# Altium schematic sheet 2代原理图.SchDoc
size A2; Organization: 电子产品世界
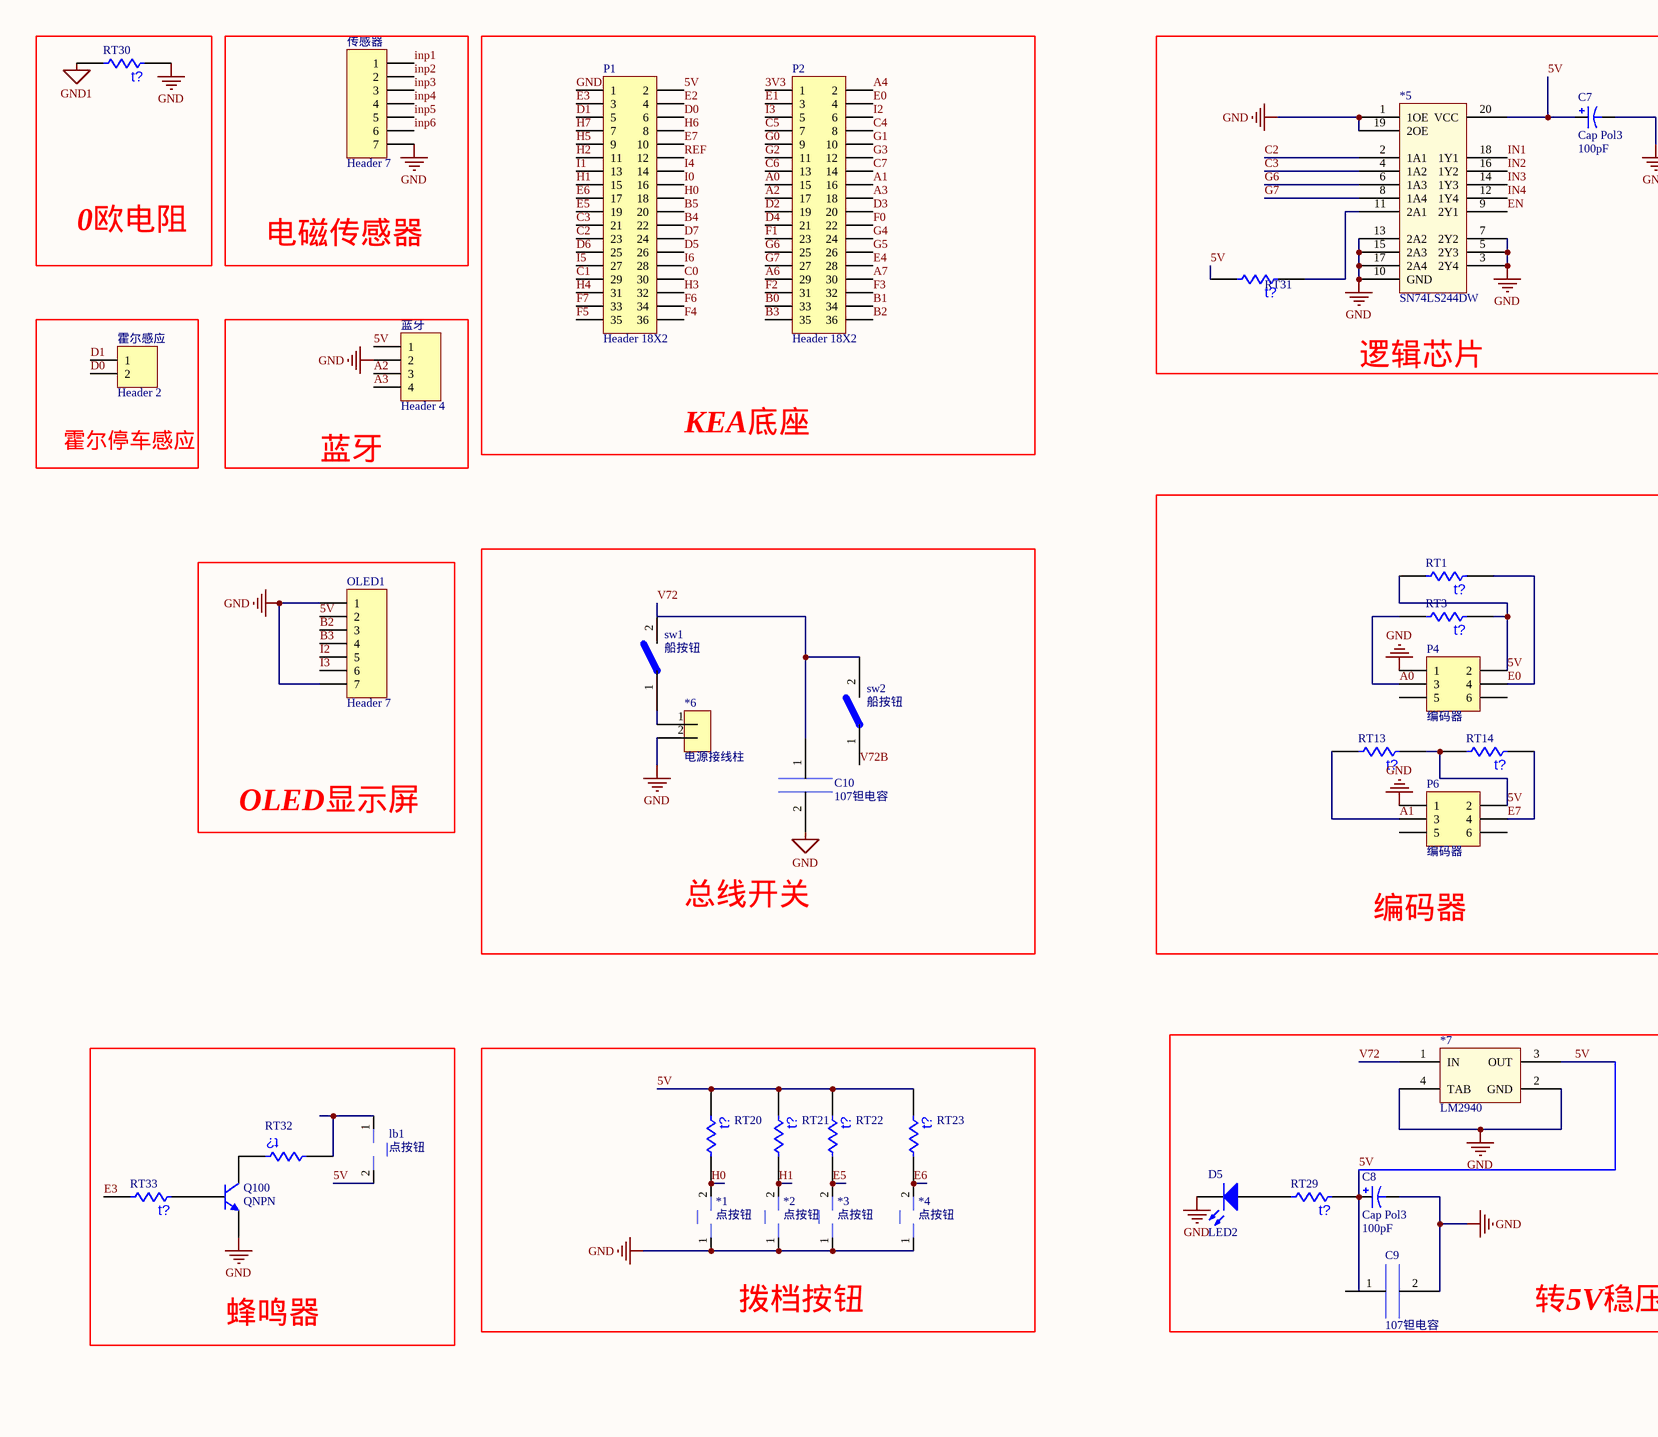
[diagram p0: 2代原理图.SchDoc, left]
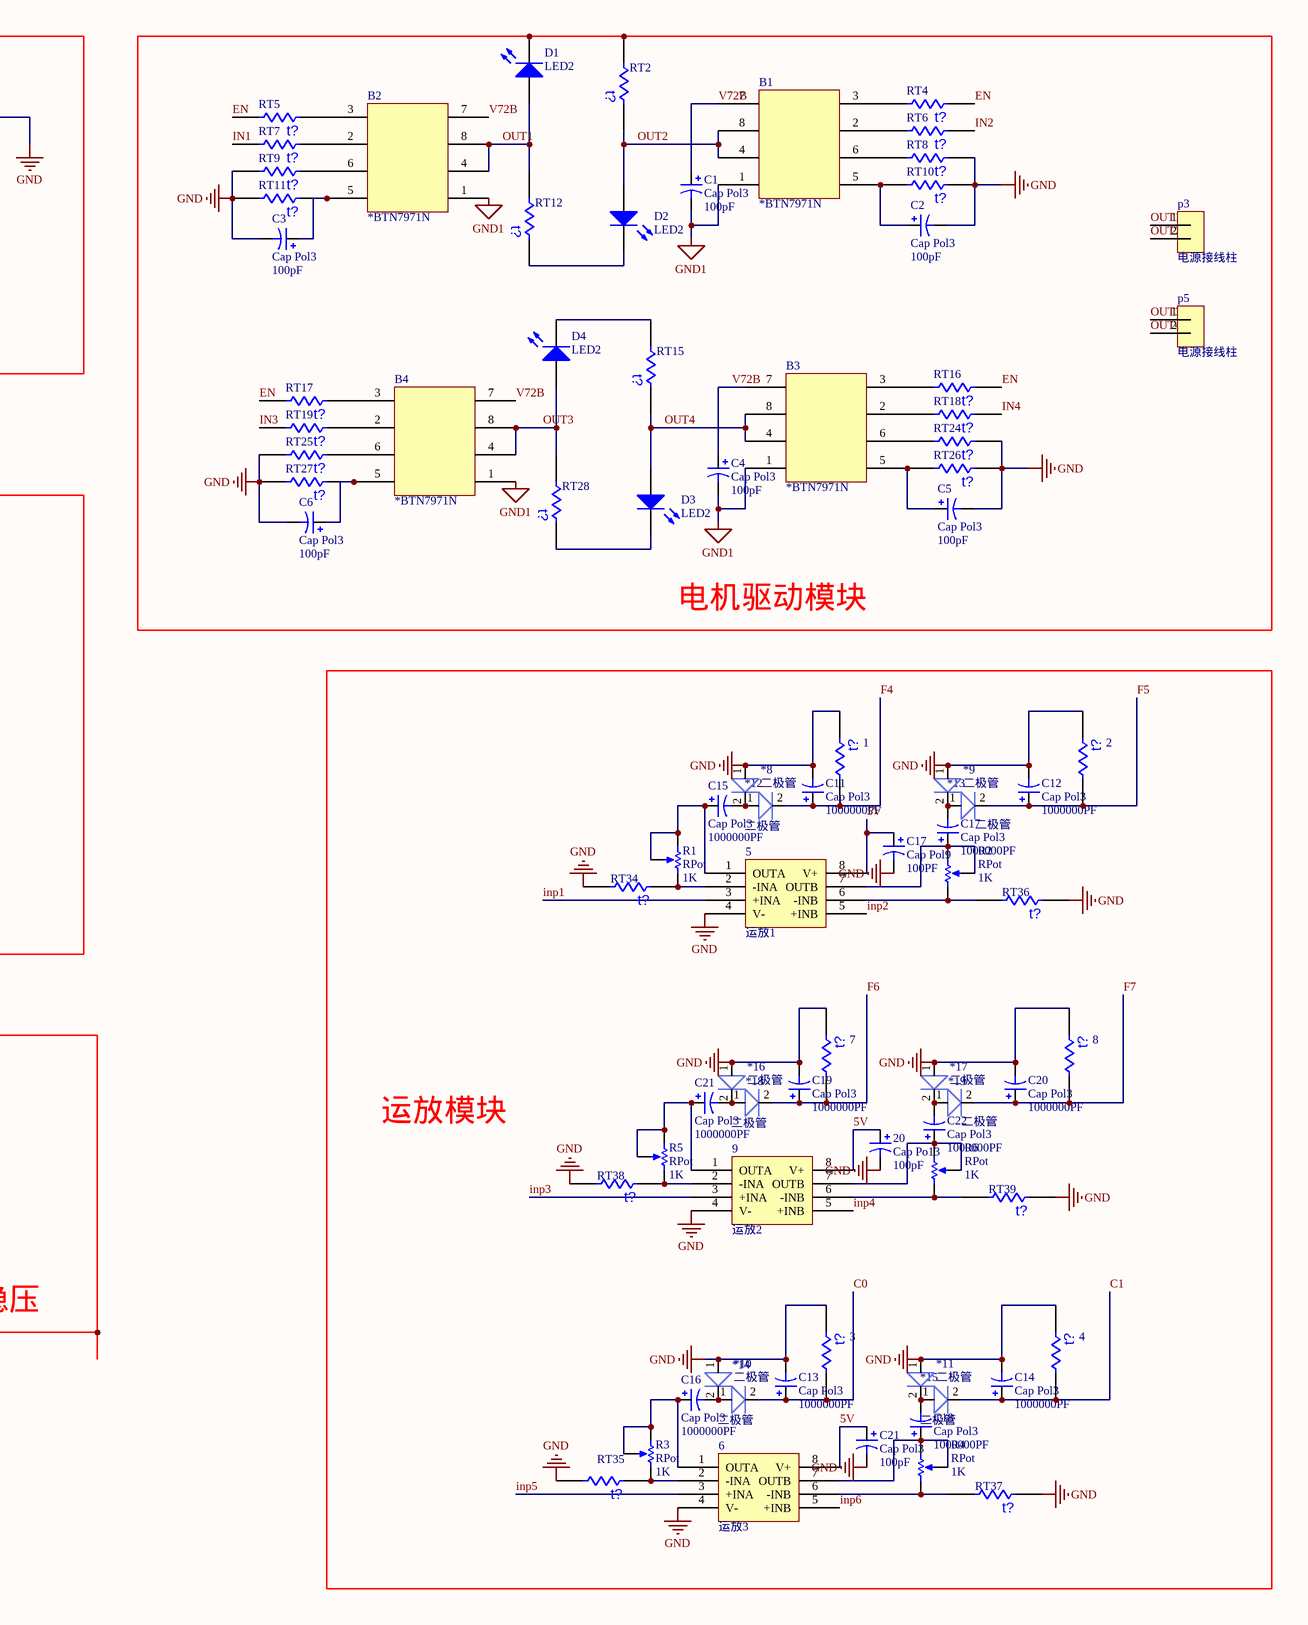
[diagram p1: 2代原理图.SchDoc, right]

## Parts
(Parts that share a designator on the sheet are numbered #1, #2 ... from top to bottom, then left to right.)
1  3.3K  [6-0805_M]  (value not drawn)
2  3.3K  [6-0805_M]  (value not drawn)
3  3.3K  [6-0805_M]  (value not drawn)
4  3.3K  [6-0805_M]  (value not drawn)
5  运放1  [opa2350]
6  运放3  [opa2350]
7  3.3K  [6-0805_M]  (value not drawn)
8  3.3K  [6-0805_M]  (value not drawn)
9  运放2  [opa2350]
20  Cap Po13  value 100pF  [C0805]
*1  点按钮  [贴片按键]
*2  点按钮  [贴片按键]
*3  点按钮  [贴片按键]
*4  点按钮  [贴片按键]
*5  SN74LS244DW  [74lvc]
*6  电源接线柱  [接线柱]
*7  LM2940  [5v芯片]
*8  二极管  [二极管]
*9  二极管  [二极管]
*10  二极管  [二极管]
*11  二极管  [二极管]
*12  二极管  [二极管]
*13  二极管  [二极管]
*14  二极管  [二极管]
*15  二极管  [二极管]
*16  二极管  [二极管]
*17  二极管  [二极管]
*18  二极管  [二极管]
*19  二极管  [二极管]
B1  *BTN7971N  [BTN7971]
B2  *BTN7971N  [BTN7971]
B3  *BTN7971N  [BTN7971]
B4  *BTN7971N  [BTN7971]
C1  Cap Pol3  value 100pF  [C0805]
C2  Cap Pol3  value 100pF  [C0805]
C3  Cap Pol3  value 100pF  [C0805]
C4  Cap Pol3  value 100pF  [C0805]
C5  Cap Pol3  value 100pF  [C0805]
C6  Cap Pol3  value 100pF  [C0805]
C7  Cap Pol3  value 100pF  [C0805]
C8  Cap Pol3  value 100pF  [C0805]
C9  107钽电容  [C107钽电容]
C10  107钽电容  [syk220 25v电容]
C11  Cap Pol3  value 1000000PF  [C0805]
C12  Cap Pol3  value 1000000PF  [C0805]
C13  Cap Pol3  value 1000000PF  [C0805]
C14  Cap Pol3  value 1000000PF  [C0805]
C15  Cap Pol3  value 1000000PF  [C0805]
C16  Cap Pol3  value 1000000PF  [C0805]
C17#1  Cap Pol3  value 1000000PF  [C0805]
C17#2  Cap Pol9  value 100PF  [C0805]
C18  Cap Pol3  value 1000000PF  [C0805]
C19  Cap Pol3  value 1000000PF  [C0805]
C20  Cap Pol3  value 1000000PF  [C0805]
C21#1  Cap Pol3  value 1000000PF  [C0805]
C21#2  Cap Pol3  value 100pF  [C0805]
C22  Cap Pol3  value 1000000PF  [C0805]
D1  LED2  [C0805]
D2  LED2  [C0805]
D3  LED2  [C0805]
D4  LED2  [C0805]
D5  LED2  [C0805]
lb1  点按钮  [喇叭]
OLED1  Header 7  [HDR1X7]
P1  Header 18X2  [HDR2X18]
P2  Header 18X2  [HDR2X18]
p3  电源接线柱  [接线柱]
P4  编码器  [HDR2X3]
p5  电源接线柱  [接线柱]
P6  编码器  [HDR2X3]
Q100  QNPN  [SOT23_M]
R1  RPot  value 1K  [VR5]
R2  RPot  value 1K  [VR5]
R3  RPot  value 1K  [VR5]
R4  RPot  value 1K  [VR5]
R5  RPot  value 1K  [VR5]
R6  RPot  value 1K  [VR5]
RT1  3.3K  [6-0805_M]  (value not drawn)
RT2  3.3K  [6-0805_M]  (value not drawn)
RT3  3.3K  [6-0805_M]  (value not drawn)
RT4  3.3K  [6-0805_M]  (value not drawn)
RT5  3.3K  [6-0805_M]  (value not drawn)
RT6  3.3K  [6-0805_M]  (value not drawn)
RT7  3.3K  [6-0805_M]  (value not drawn)
RT8  3.3K  [6-0805_M]  (value not drawn)
RT9  3.3K  [6-0805_M]  (value not drawn)
RT10  3.3K  [6-0805_M]  (value not drawn)
RT11  3.3K  [6-0805_M]  (value not drawn)
RT12  3.3K  [6-0805_M]  (value not drawn)
RT13  3.3K  [6-0805_M]  (value not drawn)
RT14  3.3K  [6-0805_M]  (value not drawn)
RT15  3.3K  [6-0805_M]  (value not drawn)
RT16  3.3K  [6-0805_M]  (value not drawn)
RT17  3.3K  [6-0805_M]  (value not drawn)
RT18  3.3K  [6-0805_M]  (value not drawn)
RT19  3.3K  [6-0805_M]  (value not drawn)
RT20  3.3K  [6-0805_M]  (value not drawn)
RT21  3.3K  [6-0805_M]  (value not drawn)
RT22  3.3K  [6-0805_M]  (value not drawn)
RT23  3.3K  [6-0805_M]  (value not drawn)
RT24  3.3K  [6-0805_M]  (value not drawn)
RT25  3.3K  [6-0805_M]  (value not drawn)
RT26  3.3K  [6-0805_M]  (value not drawn)
RT27  3.3K  [6-0805_M]  (value not drawn)
RT28  3.3K  [6-0805_M]  (value not drawn)
RT29  3.3K  [6-0805_M]  (value not drawn)
RT30  3.3K  [6-0805_M]  (value not drawn)
RT31  3.3K  [6-0805_M]  (value not drawn)
RT32  3.3K  [6-0805_M]  (value not drawn)
RT33  3.3K  [6-0805_M]  (value not drawn)
RT34  1K  [6-0805_M]  (value not drawn)
RT35  1K  [6-0805_M]  (value not drawn)
RT36  1K  [6-0805_M]  (value not drawn)
RT37  1K  [6-0805_M]  (value not drawn)
RT38  1K  [6-0805_M]  (value not drawn)
RT39  1K  [6-0805_M]  (value not drawn)
sw1  船按钮  [船按键]
sw2  船按钮  [船按键]
传感器  Header 7  [HDR1X7]
蓝牙  Header 4  [HDR1X4]
霍尔感应  Header 2  [HDR1X2]

## Nets
GND: 1.1 2.1 3.1 4.1 5.4(V-) 6.4(V-) 7.1 8.1 9.4(V-) 20.2 *1.1 *2.1 *3.1 *4.1 *5.1(1OE) *5.3(2Y4) *5.5(2Y3) *5.7(2Y2) *5.10(GND) *5.13(2A2) *5.15(2A3) *5.17(2A4) *5.19(2OE) *6.2 *7.2(GND) *7.4(TAB) *8.1 *9.1 *10.1 *11.1 *16.1 *17.1 C2.2 C3.2 C5.2 C6.2 C7.2 C8.2 C9.2 C10.2 C11.2 C12.2 C13.2 C14.2 C17#2.2 C19.2 C20.2 C21#2.2 D5.2(K) OLED1.1 OLED1.7 P1.1 P4.1 P6.1 Q100.3(E) RT8.1 RT9.2 RT10.1 RT11.2 RT24.1 RT25.2 RT26.1 RT27.2 RT30.1 RT34.2 RT35.2 RT36.1 RT37.1 RT38.2 RT39.1 传感器.7 蓝牙.2
GND1: B1.1 B2.1 B3.1 B4.1 C1.2 C4.2 RT30.2
3V3: P2.1
5V: 5.8(V+) 6.8(V+) 9.8(V+) 20.1 *5.20(VCC) *7.3(OUT) C7.1 C8.1 C9.1 C17#2.1 C21#2.1 lb1.2 OLED1.2 P1.2 P4.2 P6.2 RT1.2 RT3.1 RT13.1 RT14.2 RT20.1 RT21.1 RT22.1 RT23.1 RT29.1 RT31.2 蓝牙.1
A0: P2.15 P4.3 RT3.2
A1: P2.16 P6.3 RT13.2
A2: P2.17 蓝牙.3
A3: P2.18 蓝牙.4
A4: P2.2
A6: P2.29
A7: P2.30
B0: P2.33
B1: P2.34
B2: OLED1.3 P2.36
B3: OLED1.4 P2.35
B4: P1.22
B5: P1.20
C0: 3.2 *14.2 C13.1 P1.30
C1: 4.2 *15.2 C14.1 P1.29
C2: *5.2(1A1) P1.23
C3: *5.4(1A2) P1.21
C4: P2.8
C5: P2.7
C6: P2.13
C7: P2.14
D0: P1.6 霍尔感应.2
D1: P1.5 霍尔感应.1
D2: P2.19
D3: P2.20
D4: P2.21
D5: P1.26
D6: P1.25
D7: P1.24
E0: P2.4 P4.4 RT1.1
E1: P2.3
E2: P1.4
E3: P1.3 RT33.2
E4: P2.28
E5: *3.2 P1.19 RT22.2
E6: *4.2 P1.17 RT23.2
E7: P1.10 P6.4 RT14.1
EN: *5.9(2Y1) RT4.1 RT5.2 RT16.1 RT17.2
F0: P2.22
F1: P2.23
F2: P2.31
F3: P2.32
F4: 1.2 *12.2 C11.1 P1.36
F5: 2.2 *13.2 C12.1 P1.35
F6: 7.2 *18.2 C19.1 P1.34
F7: 8.2 *19.2 C20.1 P1.33
G0: P2.9
G1: P2.10
G2: P2.11
G3: P2.12
G4: P2.24
G5: P2.26
G6: *5.6(1A3) P2.25
G7: *5.8(1A4) P2.27
H0: *1.2 P1.18 RT20.2
H1: *2.2 P1.15 RT21.2
H2: P1.11
H3: P1.32
H4: P1.31
H5: P1.9
H6: P1.8
H7: P1.7
I0: P1.16
I1: P1.13
I2: OLED1.5 P2.6
I3: OLED1.6 P2.5
I4: P1.14
I5: P1.27
I6: P1.28
IN1: *5.18(1Y1) RT7.2
IN2: *5.16(1Y2) RT6.1
IN3: *5.14(1Y3) RT19.2
IN4: *5.12(1Y4) RT18.1
inp1: 5.3(+INA) 传感器.1
inp2: 5.5(+INB) 传感器.2
inp3: 9.3(+INA) 传感器.3
inp4: 9.5(+INB) 传感器.4
inp5: 6.3(+INA) 传感器.5
inp6: 6.5(+INB) 传感器.6
OUT1: B2.4 B2.8 D1.1(A) p3.1 RT12.2
OUT2: B1.4 B1.8 D2.1(A) p3.2 RT2.1
OUT3: B4.4 B4.8 D4.1(A) p5.1 RT28.2
OUT4: B3.4 B3.8 D3.1(A) p5.2 RT15.1
REF: P1.12
V72: *7.1(IN) C10.1 sw1.2 sw2.2
V72B: B1.7 B2.7 B3.7 B4.7 C1.1 C4.1 sw2.1
Net5_1: 5.1(OUTA) C15.1 R1.1(TOP) R1.3(TAP)
Net5_2: 5.2(-INA) R1.2(BOT) RT34.1
Net5_6: 5.6(-INB) R2.1(TOP) RT36.2
Net5_7: 5.7(OUTB) C17#1.1 R2.2(BOT) R2.3(TAP)
Net6_1: 6.1(OUTA) C16.1 R3.1(TOP) R3.3(TAP)
Net6_2: 6.2(-INA) R3.2(BOT) RT35.1
Net6_6: 6.6(-INB) R4.1(TOP) RT37.2
Net6_7: 6.7(OUTB) C18.1 R4.2(BOT) R4.3(TAP)
Net9_1: 9.1(OUTA) C21#1.1 R5.1(TOP) R5.3(TAP)
Net9_2: 9.2(-INA) R5.2(BOT) RT38.1
Net9_6: 9.6(-INB) R6.1(TOP) RT39.2
Net9_7: 9.7(OUTB) C22.1 R6.2(BOT) R6.3(TAP)
Net*5_11: *5.11(2A1) RT31.1
Net*6_1: *6.1 sw1.1
Net*8_2: *8.2 *12.1 C15.2
Net*9_2: *9.2 *13.1 C17#1.2
Net*10_2: *10.2 *14.1 C16.2
Net*11_2: *11.2 *15.1 C18.2
Net*16_2: *16.2 *18.1 C21#1.2
Net*17_2: *17.2 *19.1 C22.2
NetB1_2: B1.2 RT6.2
NetB1_3: B1.3 RT4.2
NetB1_5: B1.5 C2.1 RT10.2
NetB1_6: B1.6 RT8.2
NetB2_2: B2.2 RT7.1
NetB2_3: B2.3 RT5.1
NetB2_5: B2.5 C3.1 RT11.1
NetB2_6: B2.6 RT9.1
NetB3_2: B3.2 RT18.2
NetB3_3: B3.3 RT16.2
NetB3_5: B3.5 C5.1 RT26.2
NetB3_6: B3.6 RT24.2
NetB4_2: B4.2 RT19.1
NetB4_3: B4.3 RT17.1
NetB4_5: B4.5 C6.1 RT27.1
NetB4_6: B4.6 RT25.1
NetD1_2: D1.2(K) RT2.2
NetD2_2: D2.2(K) RT12.1
NetD3_2: D3.2(K) RT28.1
NetD4_2: D4.2(K) RT15.2
NetD5_1: D5.1(A) RT29.2
Netlb1_1: lb1.1 RT32.2
NetQ100_1: Q100.1(C) RT32.1
NetQ100_2: Q100.2(B) RT33.1

Not connected (* = marked no-connect by the designer): P4 5 6; P6 5 6

## Notes on the sheet
- 0欧电阻
- 电磁传感器
- 逻辑芯片
- 霍尔停车感应
- 蓝牙
- KEA底座
- 电机驱动模块
- OLED显示屏
- 总线开关
- 编码器
- 运放模块
- 蜂鸣器
- 拨档按钮
- 转5V稳压
- (in symbol Res Thermal) t?

## Library data of the parts
1-4 7 8 RT1-RT39 = Res Thermal: Thermis; Published: 24-Mar-1999; LatestRevisionDate: 29-May-2009; LatestRevisionNote: IPC-7351 Footprint Added.; PackageVersion: Mar-2003; PackageReference: 6-0805; Publisher: Altium Limited; PackageDescription: Chip Resistor 0805 Case Size; Code_IPC: RESC2012
5 6 9 = Component_1
20 C1-C8 C11-C16 C17#1 C17#2 C18-C20 C21#1 C21#2 C22 = Cap Pol3: Polarized Capacitor (Surface Mount); Published: 8-Jun-2000; LatestRevisionDate: 29-May-2009; LatestRevisionNote: IPC-7351 Footprint Added.; PackageReference: C0805; Publisher: Altium Limited; PackageDescription: Chip Capacitor
*5 = OV7640
B1-B4 = BTN7971N
D1-D5 = LED2: Typical RED, GREEN, YELLOW, AMBER GaAs LED; Published: 8-Jun-2000; LatestRevisionDate: 17-Jul-2002; LatestRevisionNote: Re-released for DXP Platform.; PackageVersion: Feb-2002; PackageReference: 3.2X1.6X1.1; Publisher: Altium Limited; PackageDescription: SM LED; 2 Flat Leads
OLED1 传感器 = Header 7: Header, 7-Pin; LatestRevisionDate: 17-Jul-2002; LatestRevisionNote: Re-released for DXP Platform.; Publisher: Altium Limited
P1 P2 = Header 18X2: Header, 18-Pin, Dual row; LatestRevisionDate: 17-Jul-2002; LatestRevisionNote: Re-released for DXP Platform.; Publisher: Altium Limited
P4 P6 = Header 3X2: Header, 3-Pin, Dual row; pin to pad: 3>4 4>3; LatestRevisionDate: 17-Jul-2002; LatestRevisionNote: Re-released for DXP Platform.; Publisher: Altium Limited
Q100 = QNPN: NPN Bipolar Transistor; Published: 8-Jun-2000; LatestRevisionDate: 29-May-2009; LatestRevisionNote: IPC-7351 Footprint Added.; PackageVersion: Aug-1999; PackageReference: SOT-23B; Publisher: Altium Limited; PackageDescription: 3-Pin SOT-23 Package 0.95 mm Pitch, 2.4 mm Lead Span
R1-R6 = RPot: Potentiometer; Sim Note: Enter the Resistance value and the set point into parameter fields.; Set Position: 0.5; Published: 8-Jun-2000; LatestRevisionDate: 17-Jul-2002; LatestRevisionNote: Re-released for DXP Platform.; PackageReference: VR5; Publisher: Altium Limited; PackageDescription: Variable Resistor, Thru-Hole; 3 Leads
蓝牙 = Header 4: Header, 4-Pin; LatestRevisionDate: 17-Jul-2002; LatestRevisionNote: Re-released for DXP Platform.; Publisher: Altium Limited
霍尔感应 = Header 2: Header, 2-Pin; LatestRevisionDate: 17-Jul-2002; LatestRevisionNote: Re-released for DXP Platform.; Publisher: Altium Limited